# Altium project driver2layer.PrjPCB
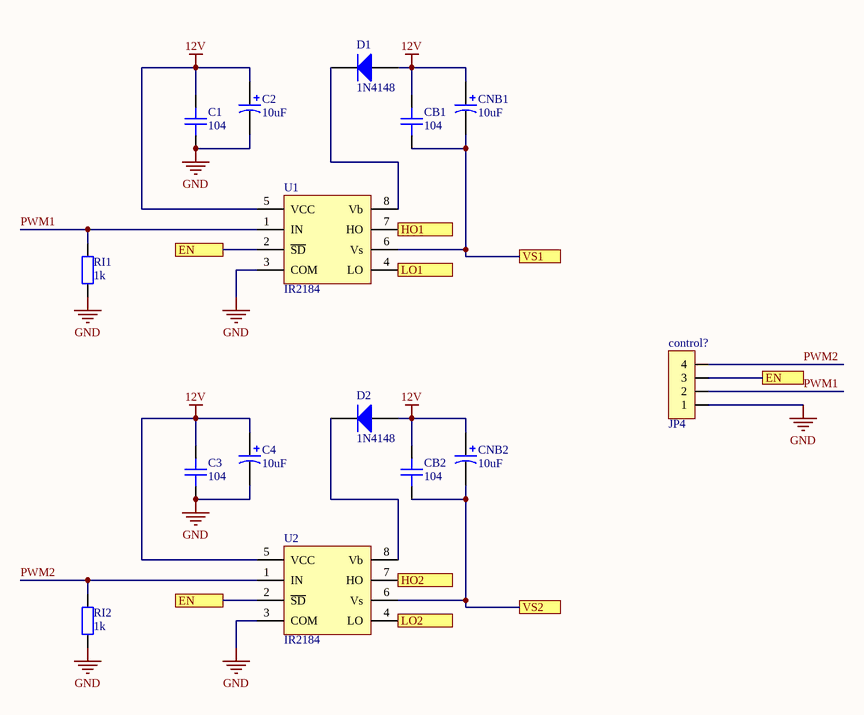
[diagram p0: driver.SchDoc]
2 sheets, 43 parts. Net scope: flat (ports and power ports of the same name join across sheets).
Board file: H_bridge_2_layers.PcbDoc
Sheets:
  driver.SchDoc
  H_bridge.SchDoc

## Sheet driver.SchDoc
size A

### Parts
C1  104  [CAPC-0603 (1608)]
C2  10uF  [CAP_ALUM_SMT_NICHICON_H8xH10]
C3  104  [CAPC-0603 (1608)]
C4  10uF  [CAP_ALUM_SMT_NICHICON_H8xH10]
CB1  104  [CAPC-0603 (1608)]
CB2  104  [CAPC-0603 (1608)]
CNB1  10uF  [CAP_ALUM_SMT_NICHICON_H8xH10]
CNB2  10uF  [CAP_ALUM_SMT_NICHICON_H8xH10]
control?  JP4  [JP4-C1T]
D1  1N4148  [SOD-123]
D2  1N4148  [SOD-123]
RI1  1k  [RESC-0603 (1608)]
RI2  1k  [RESC-0603 (1608)]
U1  IR2184  [DIP8/W0.3]
U2  IR2184  [DIP8/W0.3]

### Ports
EN, HO1, HO2, LO1, LO2, VS1, VS2

### Nets
12V: C1.2 C2.1 C3.2 C4.1 CB1.2 CB2.2 CNB1.1 CNB2.1 D1.1(A) D2.1(A) U1.5(VCC) U2.5(VCC)
GND: C1.1 C2.2 C3.1 C4.2 control?.1 RI1.1 RI2.1 U1.3(COM) U2.3(COM)
PWM1: control?.2 RI1.2 U1.1(IN)
PWM2: control?.4 RI2.2 U2.1(IN)
NetCB1_1: CB1.1 CNB1.2 U1.6(Vs) ; port VS1
NetCB2_1: CB2.1 CNB2.2 U2.6(Vs) ; port VS2
Netcontrol?_3: control?.3 U1.2(~{SD}) U2.2(~{SD}) ; port EN
NetD1_2: D1.2(K) U1.8(Vb)
NetD2_2: D2.2(K) U2.8(Vb)
NetDGH1_2: U1.7(HO) ; port HO1
NetDGH2_2: U2.7(HO) ; port HO2
NetDGL1_2: U1.4(LO) ; port LO1
NetDGL2_2: U2.4(LO) ; port LO2

### Library data of the parts
C1 C3 CB1 CB2 = 0603N331J500CT: CAP CER 330PF 50V C0G/NP0 0603; MFR: Walsin Technology Corporation; Solder: SMT; Value: 330p/50V; MPN: 0603N331J500CT; Category: CAPACITOR; PinCount: 2
C2 C4 CNB1 CNB2 = UWT1H101MNL1GS: CAP ALUM 100UF 20% 50V SMD; Value: 100uF/50V; Solder: SMT; MPN: UWT1H101MNL1GS; Category: CAPACITOR; PinCount: 2
control? = JP4: WR-PHD 2.54 mm Angled Socket Header; Manufacturer: W¨¹rth Elektronik eiSos GmbH; partNo: 613004143121; ComponentLink1 Description: Manufacturer; ComponentLink2 Description: Datasheet; NoPins: 04; Created Date: 29 March 2013; ComponentLink1URL: http://www.we-online.com; ComponentLink2URL: http://katalog.we-online.de/em/datasheet/6130xx143121.pdf; Created by: Karrer Zheng
D1 D2 = 1N4148-W-7: DIODE GEN PURP 100V 300MA SOD123; MPN: 1N4148W-7-F; MFR: Diodes Incorporated; Solder: SMT; Value: 100V/300MA
RI1 RI2 = RESC NF 0603: RES SMD, Not Fill, 0603; Value: NF; Solder: Not Fill; Category: RESISTOR
U1 U2 = IR2184: Half-Bridge Driver

## Sheet H_bridge.SchDoc
size A
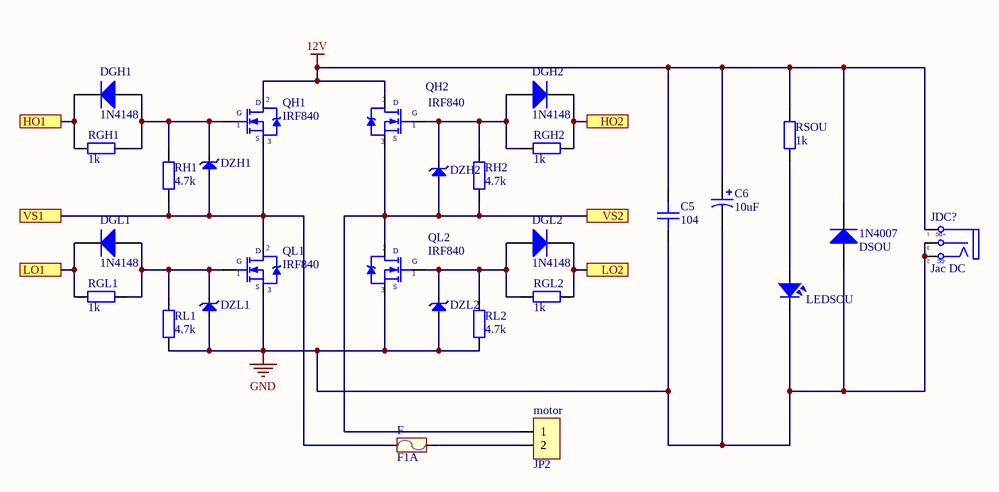
[diagram p1: H_bridge.SchDoc]

### Parts
1N4007  DSOU  [DIODE_DO214AC_SMA]
C5  104  [CAPC-0603 (1608)]
C6  10uF  [CAP_ALUM_SMT_NICHICON_H8xH10]
DGH1  1N4148  [SOD-123]
DGH2  1N4148  [SOD-123]
DGL1  1N4148  [SOD-123]
DGL2  1N4148  [SOD-123]
DZH1  DIODE Zener  [DIO-0.5A-SMALL]  (value not drawn)
DZH2  DIODE Zener  [DIO-0.5A-SMALL]  (value not drawn)
DZL1  DIODE Zener  [DIO-0.5A-SMALL]  (value not drawn)
DZL2  DIODE Zener  [DIO-0.5A-SMALL]  (value not drawn)
F  F1A  [Fuse]
JDC?  Jac DC  [DC-IN]
LEDSOU  LED  [LED-3]  (value not drawn)
motor  JP2  [JP2-C1T]
QH1  IRF840  [QTO-220]
QH2  IRF840  [QTO-220]
QL1  IRF840  [QTO-220]
QL2  IRF840  [QTO-220]
RGH1  1k  [RESC-0603 (1608)]
RGH2  1k  [RESC-0603 (1608)]
RGL1  1k  [RESC-0603 (1608)]
RGL2  1k  [RESC-0603 (1608)]
RH1  4.7k  [RESC-0603 (1608)]
RH2  4.7k  [RESC-0603 (1608)]
RL1  4.7k  [RESC-0603 (1608)]
RL2  4.7k  [RESC-0603 (1608)]
RSOU  1k  [RESC-0603 (1608)]

### Ports
HO1, HO2, LO1, LO2, VS1, VS2

### Nets
12V: 1N4007.2(K) C5.2 C6.1 JDC?.1(T) QH1.2(D) QH2.2(D) RSOU.2
GND: 1N4007.1(A) C5.1 C6.2 DZL1.1(A) DZL2.1(A) JDC?.2(TN) JDC?.3(S) LEDSOU.2 QL1.3(S) QL2.3(S) RL1.1 RL2.1
NetCB1_1: DZH1.1(A) F.1 QH1.3(S) QL1.2(D) RH1.1 ; port VS1
NetCB2_1: DZH2.1(A) motor.1 QH2.3(S) QL2.2(D) RH2.1 ; port VS2
NetDGH1_1: DGH1.1(A) DZH1.2(K) QH1.1(G) RGH1.1 RH1.2
NetDGH1_2: DGH1.2(K) RGH1.2 ; port HO1
NetDGH2_1: DGH2.1(A) DZH2.2(K) QH2.1(G) RGH2.2 RH2.2
NetDGH2_2: DGH2.2(K) RGH2.1 ; port HO2
NetDGL1_1: DGL1.1(A) DZL1.2(K) QL1.1(G) RGL1.1 RL1.2
NetDGL1_2: DGL1.2(K) RGL1.2 ; port LO1
NetDGL2_1: DGL2.1(A) DZL2.2(K) QL2.1(G) RGL2.2 RL2.2
NetDGL2_2: DGL2.2(K) RGL2.1 ; port LO2
NetF_2: F.2 motor.2
NetLEDSOU_1: LEDSOU.1 RSOU.1

### Notes on the sheet
- (in symbol DCIN) +DC; -DC

### Library data of the parts
1N4007 = 1N4007_SMA: DIODE GEN PURP 1KV 1A SMA; MPN: MRA4007T3G; Solder: SMT; Value: 1000V/1A; MFR: *
C5 = 0603N331J500CT: as C1 on sheet driver; MPN: 0603N331J500CT; Category: CAPACITOR; PinCount: 2
C6 = UWT1H101MNL1GS: as C2 on sheet driver; MPN: UWT1H101MNL1GS; Category: CAPACITOR; PinCount: 2
DGH1 DGH2 DGL1 DGL2 = 1N4148-W-7: as D1 on sheet driver
DZH1 DZH2 DZL1 DZL2 = DIODE Zener: Zenner
F = Fuse: Designed by: VanDungEvn; Value: Fuse
JDC? = DCIN: Jac DC input; Value: Jac DC
LEDSOU = LED: LED Single colour Green and Red; Value: LED 3 ly Single Colour
motor = JP2: WR-PHD 2.54 mm Angled Socket Header; Manufacturer: W¨¹rth Elektronik eiSos GmbH; partNo: 613002143121; ComponentLink1 Description: Manufacturer; ComponentLink2 Description: Datasheet; NoPins: 02; Created Date: 29 March 2013; ComponentLink1URL: http://www.we-online.com; ComponentLink2URL: http://katalog.we-online.de/em/datasheet/6130xx143121.pdf; Created by: Karrer Zheng
QH1 QH2 QL1 QL2 = IRF840: MOSFET N - CHANNEL 500V - 0.75 - 8A - TO-220; Value: IRF840
RGH1 RGH2 RGL1 RGL2 RH1 RH2 RL1 RL2 RSOU = RESC NF 0603: RES SMD, Not Fill, 0603; Value: NF; Solder: Not Fill; Category: RESISTOR

## Nets that join several sheets
12V: driver (12 pins), H_bridge (7 pins)
GND: driver (9 pins), H_bridge (12 pins)
NetCB1_1: driver (CB1.1 CNB1.2 U1.6), H_bridge (5 pins)
NetCB2_1: driver (CB2.1 CNB2.2 U2.6), H_bridge (5 pins)
NetDGH1_2: driver (U1.7), H_bridge (DGH1.2 RGH1.2)
NetDGH2_2: driver (U2.7), H_bridge (DGH2.2 RGH2.1)
NetDGL1_2: driver (U1.4), H_bridge (DGL1.2 RGL1.2)
NetDGL2_2: driver (U2.4), H_bridge (DGL2.2 RGL2.1)